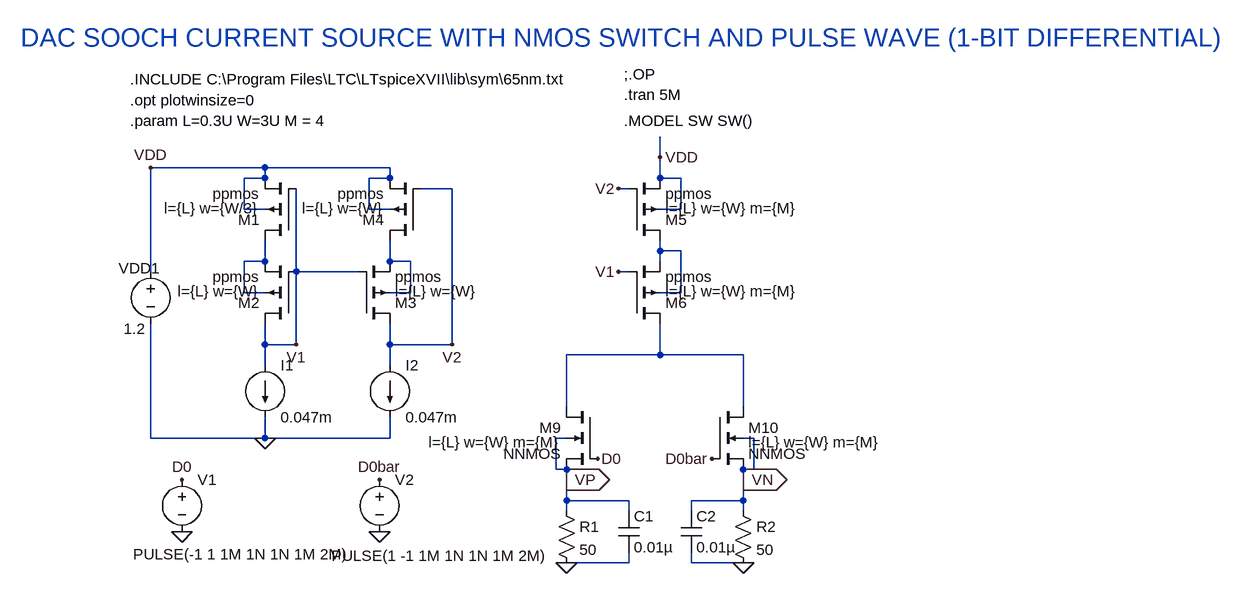
[diagram p0: schematic 105DAC_DIFF_SOOCH_NMOS_SW_PULSE_1BIT.asc]
105DAC_DIFF_SOOCH_NMOS_SW_PULSE_1BIT.asc, the LTspice schematic file:
Version 4
SHEET 1 1556 752
WIRE 480 -400 480 -432
WIRE -128 -384 -304 -384
WIRE 64 -384 -128 -384
WIRE -128 -368 -128 -384
WIRE -128 -368 -160 -368
WIRE 64 -368 64 -384
WIRE 64 -368 32 -368
WIRE 480 -368 480 -400
WIRE 512 -368 480 -368
WIRE 160 -352 112 -352
WIRE 432 -352 416 -352
WIRE -160 -320 -160 -368
WIRE -128 -320 -160 -320
WIRE 32 -320 32 -368
WIRE 64 -320 32 -320
WIRE 512 -320 512 -368
WIRE 512 -320 480 -320
WIRE 480 -256 480 -272
WIRE 512 -256 480 -256
WIRE -128 -240 -128 -272
WIRE -128 -240 -160 -240
WIRE 64 -240 64 -272
WIRE 96 -240 64 -240
WIRE 480 -240 480 -256
WIRE -304 -224 -304 -384
WIRE -80 -224 -80 -352
WIRE 16 -224 -80 -224
WIRE 432 -224 416 -224
WIRE -160 -192 -160 -240
WIRE -128 -192 -160 -192
WIRE 96 -192 96 -240
WIRE 96 -192 64 -192
WIRE 512 -192 512 -256
WIRE 512 -192 480 -192
WIRE -128 -112 -128 -144
WIRE -80 -112 -80 -224
WIRE -80 -112 -128 -112
WIRE 64 -112 64 -144
WIRE 160 -112 160 -352
WIRE 160 -112 64 -112
WIRE 480 -96 480 -144
WIRE 480 -96 336 -96
WIRE 608 -96 480 -96
WIRE -128 -80 -128 -112
WIRE 64 -80 64 -112
WIRE 336 -16 336 -96
WIRE 608 -16 608 -96
WIRE -304 32 -304 -144
WIRE -128 32 -128 0
WIRE -128 32 -304 32
WIRE 64 32 64 0
WIRE 64 32 -128 32
WIRE 336 32 320 32
WIRE 624 32 608 32
WIRE 320 80 320 32
WIRE 336 80 320 80
WIRE 624 80 624 32
WIRE 624 80 608 80
WIRE 336 96 336 80
WIRE 608 96 608 80
WIRE 336 128 336 96
WIRE 432 128 336 128
WIRE 608 128 608 96
WIRE 608 128 528 128
WIRE 336 144 336 128
WIRE 432 144 432 128
WIRE 528 144 528 128
WIRE 608 144 608 128
WIRE 432 224 432 208
WIRE 432 224 336 224
WIRE 528 224 528 208
WIRE 608 224 528 224
FLAG -80 -112 V1
FLAG 416 -224 V1
FLAG 160 -112 V2
FLAG 416 -352 V2
FLAG 480 -400 VDD
FLAG -304 -384 VDD
FLAG 336 224 0
FLAG -128 32 0
FLAG -256 176 0
FLAG -256 96 D0
FLAG 336 96 VP
IOPIN 336 96 Out
FLAG 384 64 D0
FLAG 608 224 0
FLAG 608 96 VN
IOPIN 608 96 Out
FLAG 560 64 D0bar
FLAG 48 176 0
FLAG 48 96 D0bar
SYMBOL pmos4 -80 -272 R180
WINDOW 123 56 50 Left 2
SYMATTR Value2 l={L} w={W/3}
SYMATTR InstName M1
SYMATTR Value ppmos
SYMBOL pmos4 -80 -144 R180
WINDOW 123 56 50 Left 2
SYMATTR Value2 l={L} w={W}
SYMATTR InstName M2
SYMATTR Value ppmos
SYMBOL current -128 -80 R0
WINDOW 123 0 0 Left 0
WINDOW 39 0 0 Left 0
SYMATTR InstName I1
SYMATTR Value 0.047m
SYMBOL pmos4 16 -144 M180
WINDOW 123 56 50 Left 2
SYMATTR Value2 l={L} w={W}
SYMATTR InstName M3
SYMATTR Value ppmos
SYMBOL pmos4 112 -272 R180
WINDOW 123 56 50 Left 2
SYMATTR Value2 l={L} w={W}
SYMATTR InstName M4
SYMATTR Value ppmos
SYMBOL current 64 -80 R0
WINDOW 123 0 0 Left 0
WINDOW 39 0 0 Left 0
SYMATTR InstName I2
SYMATTR Value 0.047m
SYMBOL pmos4 432 -272 M180
WINDOW 123 56 50 Left 2
SYMATTR Value2 l={L} w={W} m={M}
SYMATTR InstName M5
SYMATTR Value ppmos
SYMBOL pmos4 432 -144 M180
WINDOW 123 56 50 Left 2
SYMATTR Value2 l={L} w={W} m={M}
SYMATTR InstName M6
SYMATTR Value ppmos
SYMBOL voltage -304 -240 R0
WINDOW 123 0 0 Left 0
WINDOW 39 0 0 Left 0
WINDOW 0 -49 11 Left 2
WINDOW 3 -42 104 Left 2
SYMATTR InstName VDD1
SYMATTR Value 1.2
SYMBOL res 320 128 R0
SYMATTR InstName R1
SYMATTR Value 50
SYMBOL voltage -256 80 R0
WINDOW 123 0 0 Left 0
WINDOW 39 0 0 Left 0
WINDOW 3 -75 131 Left 2
SYMATTR Value PULSE(-1 1 1M 1N 1N 1M 2M)
SYMATTR InstName V1
SYMBOL cap 416 144 R0
SYMATTR InstName C1
SYMATTR Value 0.01µ
SYMBOL res 592 128 R0
SYMATTR InstName R2
SYMATTR Value 50
SYMBOL cap 512 144 R0
SYMATTR InstName C2
SYMATTR Value 0.01µ
SYMBOL voltage 48 80 R0
WINDOW 123 0 0 Left 0
WINDOW 39 0 0 Left 0
WINDOW 3 -74 133 Left 2
SYMATTR Value PULSE(1 -1 1M 1N 1N 1M 2M)
SYMATTR InstName V2
SYMBOL nmos4 384 -16 M0
WINDOW 123 56 54 Left 2
SYMATTR InstName M9
SYMATTR Value NNMOS
SYMATTR Value2 l={L} w={W} m={M}
SYMBOL nmos4 560 -16 R0
WINDOW 123 56 54 Left 2
SYMATTR InstName M10
SYMATTR Value NNMOS
SYMATTR Value2 l={L} w={W} m={M}
TEXT -336 -520 Left 2 !.INCLUDE C:\\Program Files\\LTC\\LTspiceXVII\\lib\\sym\\65nm.txt
TEXT -336 -488 Left 2 !.opt plotwinsize=0
TEXT 424 -528 Left 2 !;.OP
TEXT -336 -456 Left 2 !.param L=0.3U W=3U M = 4
TEXT 424 -496 Left 2 !.tran 5M
TEXT 424 -456 Left 2 !.MODEL SW SW()
TEXT -504 -584 Left 4 ;DAC SOOCH CURRENT SOURCE WITH NMOS SWITCH AND PULSE WAVE (1-BIT DIFFERENTIAL)

The netlist it stands for:
* 105DAC_DIFF_SOOCH_NMOS_SW_PULSE_1BIT.asc
M1 N002 V1 VDD VDD ppmos l={L} w={W/3}
M2 V1 V1 N002 N002 ppmos l={L} w={W}
I1 V1 0 0.047m
M3 V2 V1 N003 N003 ppmos l={L} w={W}
M4 N003 V2 VDD VDD ppmos l={L} w={W}
I2 V2 0 0.047m
M5 N001 V2 VDD VDD ppmos l={L} w={W} m={M}
M6 N004 V1 N001 N001 ppmos l={L} w={W} m={M}
VDD1 VDD 0 1.2
R1 VP 0 50
V1 D0 0 PULSE(-1 1 1M 1N 1N 1M 2M)
C1 VP 0 0.01µ
R2 VN 0 50
C2 VN 0 0.01µ
V2 D0bar 0 PULSE(1 -1 1M 1N 1N 1M 2M)
M9 N004 D0 VP VP NNMOS l={L} w={W} m={M}
M10 N004 D0bar VN VN NNMOS l={L} w={W} m={M}
.model NMOS NMOS
.model PMOS PMOS
.lib standard.mos
.INCLUDE C:\Program Files\LTC\LTspiceXVII\lib\sym\65nm.txt
.opt plotwinsize=0
;.OP
.param L=0.3U W=3U M = 4
.tran 5M
.MODEL SW SW()
* DAC SOOCH CURRENT SOURCE WITH NMOS SWITCH AND PULSE WAVE (1-BIT DIFFERENTIAL)
.backanno
.end